# Altium schematic sheet SD_Card.SchDoc
size 101 x 76 mm
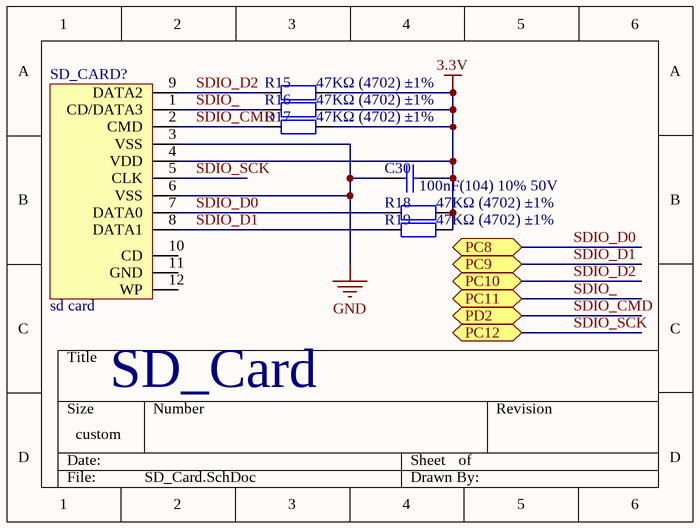
[diagram p0: SD_Card.SchDoc]

## Parts
C30  100nF(104) 10% 50V  [0805_C]
R15  47KΩ (4702) ±1%  [0805_R]
R16  47KΩ (4702) ±1%  [0805_R]
R17  47KΩ (4702) ±1%  [0805_R]
R18  47KΩ (4702) ±1%  [0805_R]
R19  47KΩ (4702) ±1%  [0805_R]
SD_CARD?  sd card  [SDCARD_L]

## Ports
PC8, PC9, PC10, PC11, PC12, PD2

## Nets
3.3V: C30.2 R15.2 R16.2 R17.2 R18.2 R19.2 SD_CARD?.4(VDD)
GND: C30.1 SD_CARD?.3(VSS) SD_CARD?.6(VSS)
SDIO_: R16.1 SD_CARD?.1(CD/DATA3) ; port PC11
SDIO_CMD: R17.1 SD_CARD?.2(CMD) ; port PD2
SDIO_D0: R18.1 SD_CARD?.7(DATA0) ; port PC8
SDIO_D1: R19.1 SD_CARD?.8(DATA1) ; port PC9
SDIO_D2: R15.1 SD_CARD?.9(DATA2) ; port PC10
SDIO_SCK: SD_CARD?.5(CLK) ; port PC12

Not connected (* = marked no-connect by the designer): SD_CARD? 10(CD) 11(GND) 12(WP)

## Notes on the sheet
- (near SD_CARD?) SD_Card

## Library data of the parts
C30 = 0805 100nF(104) 10% 50V: 贴片电容; ComponentLink1Description: 供应商链接; ComponentLink1URL: http://www.szlcsc.com/product/details_50686.html; Package: 0805; Supplier: LC; SuppliersPartNumber: C49678
R15-R19 = 0805 47KΩ (4702) 1%: 贴片电阻; ComponentLink1Description: 供应商链接; ComponentLink1URL: http://www.szlcsc.com/product/details_18401.html; Package: 0805; Supplier: LC; SuppliersPartNumber: C17713